# EAGLE design NRF24 (EAGLE 6.5.0)
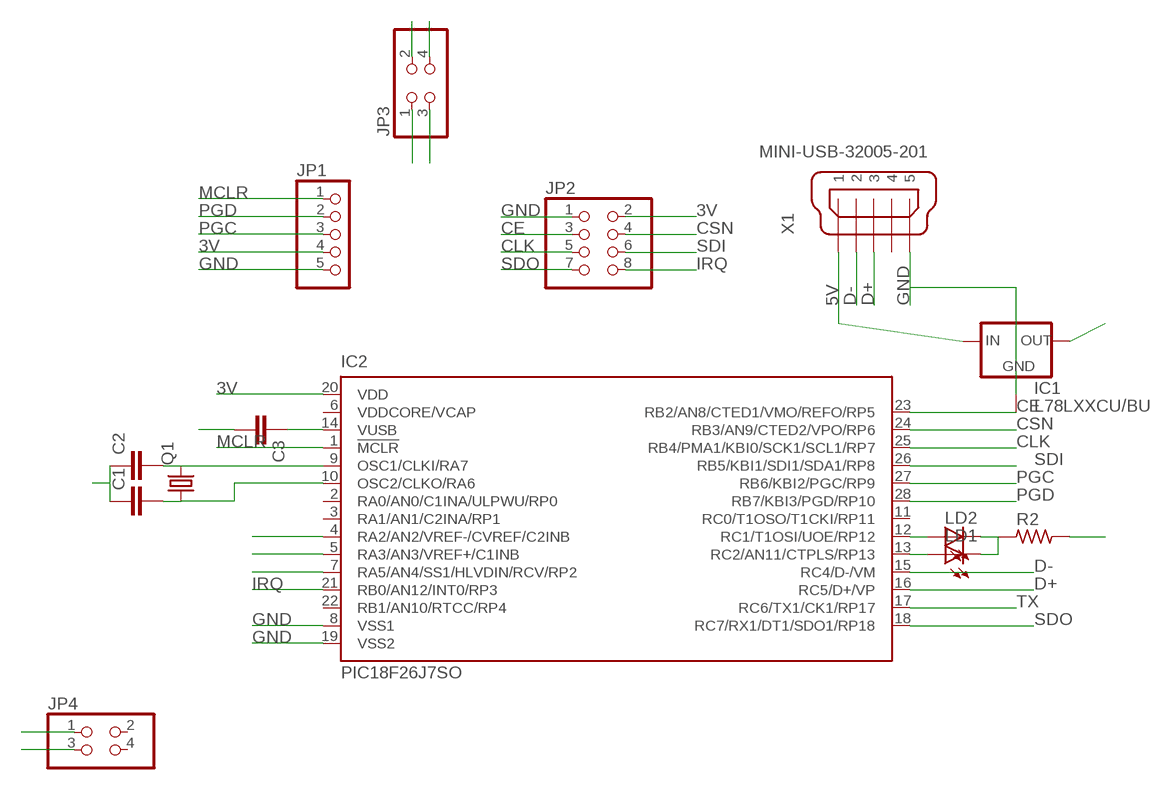
[diagram p0: schematic, sheet 1]

## Parts
C1  C-EU025-025X050  [C025-025X050]
C2  C-EU025-025X050  [C025-025X050]
C3  C-EU050-025X075  [C050-025X075]
IC1  L78LXXCU/BU  [SOT89]
IC2  PIC18F26J7SO  [SO28W]
JP1  PINHD-1X5  [1X05]
JP2  PINHD-2X4  [2X04]
JP3  PINHD-2X2  [2X02]
JP4  PINHD-2X2  [2X02]
LD1  LED5MM  [LED5MM]
LD2  LED5MM  [LED5MM]
Q1  CRYTALHC49S  [HC49/S]
R2  R_X0204/5  [0204/5]
X1  MINI-USB-32005-201  [32005-201]

## Nets
3V: IC1.1(OUT) IC2.20(VDD) JP1.4 JP2.2
5V: IC1.3(IN) X1.1
CE: IC2.23(RB2/AN8/CTED1/VMO/REFO/RP5) JP2.3
CLK: IC2.25(RB4/PMA1/KBI0/SCK1/SCL1/RP7) JP2.5
CSN: IC2.24(RB3/AN9/CTED2/VPO/RP6) JP2.4
D+: IC2.16(RC5/D+/VP) X1.3
D-: IC2.15(RC4/D-/VM) X1.2
GND: C1.1 C2.1 C3.2 IC1.2(GND) IC2.8(VSS1) IC2.19(VSS2) JP1.5 JP2.1 R2.2 X1.5
IRQ: IC2.21(RB0/AN12/INT0/RP3) JP2.8
MCLR: IC2.1(!MCLR) JP1.1
N$1: IC2.13(RC2/AN11/CTPLS/RP13) LD1.A
N$2: LD1.K(C) LD2.K(C) R2.1
N$3: IC2.12(RC1/T1OSI/UOE/RP12) LD2.A
N$4: C1.2 IC2.10(OSC2/CLKO/RA6) Q1.1
N$5: C2.2 IC2.9(OSC1/CLKI/RA7) Q1.2
N$6: C3.1 IC2.14(VUSB)
N$10: JP3.4
PGC: IC2.27(RB6/KBI2/PGC/RP9) JP1.3
PGD: IC2.28(RB7/KBI3/PGD/RP10) JP1.2
RA2: IC2.4(RA2/AN2/VREF-/CVREF/C2INB) JP3.1
RA3: IC2.5(RA3/AN3/VREF+/C1INB) JP3.3
RA5: IC2.7(RA5/AN4/SS1/HLVDIN/RCV/RP2) JP3.2
SDI: IC2.26(RB5/KBI1/SDI1/SDA1/RP8) JP2.6
SDO: IC2.18(RC7/RX1/DT1/SDO1/RP18) JP2.7 JP4.1
TX: IC2.17(RC6/TX1/CK1/RP17) JP4.3
Unconnected: IC1.4(GND1) IC2.2(RA0/AN0/C1INA/ULPWU/RP0) IC2.3(RA1/AN1/C2INA/RP1) IC2.6(VDDCORE/VCAP) IC2.11(RC0/T1OSO/T1CKI/RP11) IC2.22(RB1/AN10/RTCC/RP4) JP4.2 JP4.4 X1.4

## Library data of the parts
C1 C2 = rcl-2:C-EU: CAPACITOR, European symbol
C3 = qfm-trx1-24g:C-EU: CAPACITOR, European symbol
IC1 = v-reg-3:L78LXXCU/BU: VOLTAGE REGULATOR
IC2 = microchip-dspic:PIC18F26J*: PIC18F47J53 Family High-Performance USB Microcontrollers with nanoWatt XLP Technology Source: Data sheet <http://ww1.microchip.com/downloads/en/DeviceDoc/39964B.pdf>; MPN: PIC18F27J53-I/SO; OC_FARNELL: unknown; OC_NEWARK: 63R7838
JP1 = pinhead 2:PINHD-1X5: PIN HEADER
JP2 = pinhead 2:PINHD-2X4: PIN HEADER
JP3 JP4 = pinhead 2:PINHD-2X2: PIN HEADER
LD1 LD2 = led 2:LED: LED OSRAM: - CHIPLED LG R971, LG N971, LY N971, LG Q971, LY Q971, LO R971, LY R971 LH N974, LH R974 LS Q976, LO Q976, LY Q976 LO Q996 - Hyper CHIPLED LW Q18S LB Q993, LB Q99A, LB R99A - SideLED LS A670, LO A670, LY A670, LG A670, LP A670 LB A673, LV A673, LT A673, LW A673 LH A674 LY A675 LS A676, LA A676, LO A676, LY A676, LW A676 LS A679, LY A679, LG A679 - Hyper Micro SIDELED® LS Y876, LA Y876, LO Y876, LY Y876 LT Y87S - SmartLED LW L88C, LW L88S LB L89C, LB L89S, LG L890 LS L89K, LO L89K, LY L89K LS L896, LA L896, LO L896, LY L896 - TOPLED LS T670, LO T670, LY T670, LG T670, LP T670 LSG T670, LSP T670, LSY T670, LOP T670, LYG T670 LG T671, LOG T671, LSG T671 LB T673, LV T673, LT T673, LW T673 LH T674 LS T676, LA T676, LO T676, LY T676, LB T676, LH T676, LSB T676, LW T676 LB T67C, LV T67C, LT T67C, LS T67K, LO T67K, LY T67K, LW E67C LS E67B, LA E67B, LO E67B, LY E67B, LB E67C, LV E67C, LT E67C LW T67C LS T679, LY T679, LG T679 LS T770, LO T770, LY T770, LG T770, LP T770 LB T773, LV T773, LT T773, LW T773 LH T774 LS E675, LA E675, LY E675, LS T675 LS T776, LA T776, LO T776, LY T776, LB T776 LHGB T686 LT T68C, LB T68C - Hyper Mini TOPLED® LB M676 - Mini TOPLED Santana® LG M470 LS M47K, LO M47K, LY M47K Source: http://www.osram.convergy.de/
Q1 = crystal 2:CRYTAL: CRYSTAL
R2 = rc-master:R_: RESISTOR
X1 = con-cypressindustries 2:MINI-USB-: MINI USB-B Conector Source: www.cypressindustries.com

## Board
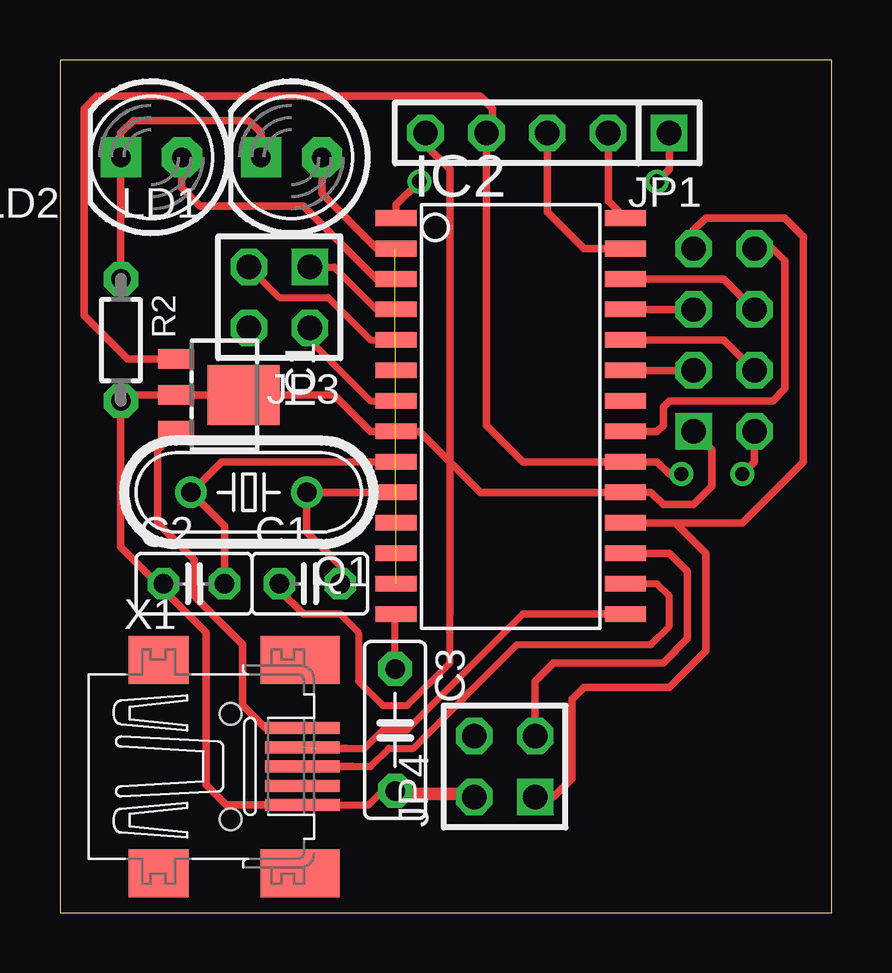
[diagram p1: board, top side]
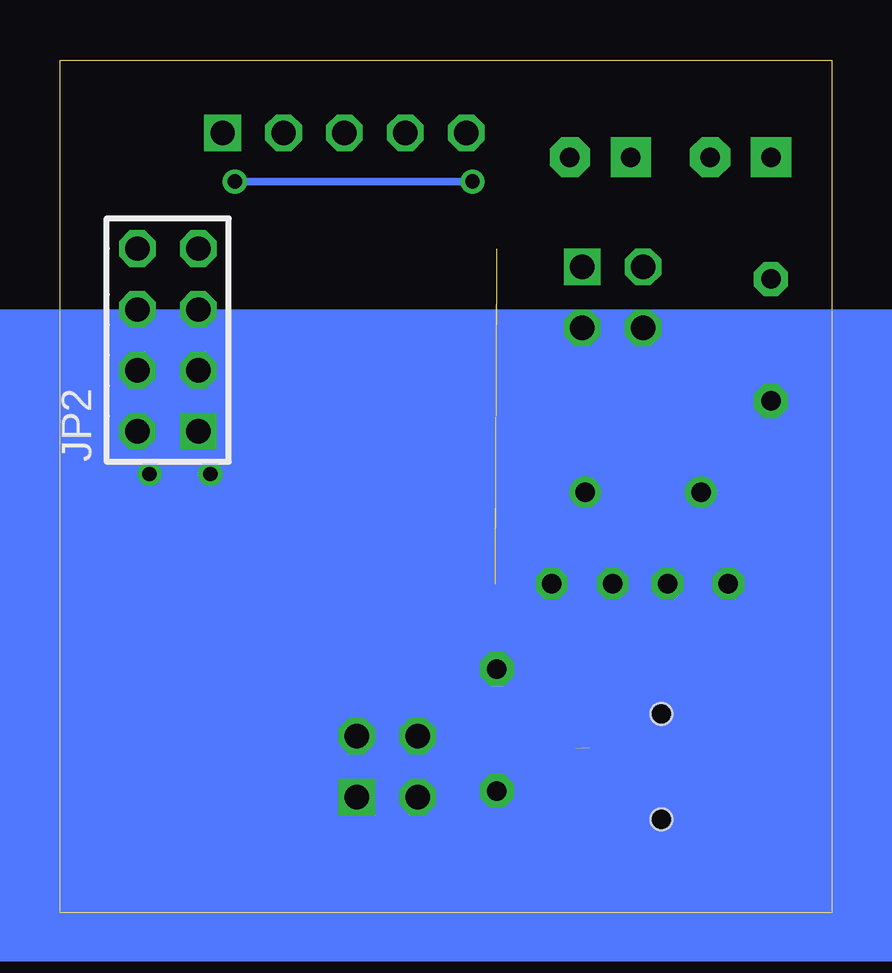
[diagram p2: board, bottom side, seen from below]

Size 32.18 x 35.55 mm. Coordinates in mm from the lower left corner, seen from the top.
Outline: 0,0 32.18,0 32.18,35.55 0,35.55 0,0
Copper layers (1*16): Top 0.035mm / dielectric 1.5mm / Bottom 0.035mm
Design rules "default": minimum track width 10mil, minimum drill 24mil, track to track 8mil, track to pad 8mil, pad to pad 8mil, via to via 8mil, smd to smd 8mil, copper to edge 40mil, drill to drill 8mil, minimum pad ring 10mil, minimum via ring 8mil, stop-mask expansion 4mil, vias tented up to drill 0mil, thermal gap 10mil

### Footprints (pad centres in the part's own frame; a part is rotated, then mirrored left to right if it is on the bottom)
C025-025X050 = drill 0.813 octagon: 1 -1.27,0; 2 1.27,0
C050-025X075 = drill 0.813 pad 1.422 octagon: 1 -2.54,0; 2 2.54,0
SOT89 = smd 0.8 x 1.5: 1 -1.5,-1.75; 2 0,-1.75; 3 1.5,-1.75 | smd 2.5 x 3: 4 0,1.05
SO28W = smd 0.65 x 1.7: 1 -7.62,-4.78; 2 -6.35,-4.78; 3 -5.08,-4.78; 4 -3.81,-4.78; 5 -2.54,-4.78; 6 -1.27,-4.78; 7 0,-4.78; 8 1.27,-4.78; 9 2.54,-4.78; 10 3.81,-4.78; 11 5.08,-4.78; 12 6.35,-4.78; 13 7.62,-4.78; 14 8.89,-4.78; 15 8.89,4.78; 16 7.62,4.78; 17 6.35,4.78; 18 5.08,4.78; 19 3.81,4.78; 20 2.54,4.78; 21 1.27,4.78; 22 0,4.78; 23 -1.27,4.78; 24 -2.54,4.78; 25 -3.81,4.78; 26 -5.08,4.78; 27 -6.35,4.78; 28 -7.62,4.78
1X05 = drill 1.016 square: 1 -5.08,0 | drill 1.016 octagon: 2 -2.54,0; 3 0,0; 4 2.54,0; 5 5.08,0
2X04 = drill 1.016 square: 1 -3.81,-1.27 | drill 1.016 octagon: 2 -3.81,1.27; 3 -1.27,-1.27; 4 -1.27,1.27; 5 1.27,-1.27; 6 1.27,1.27; 7 3.81,-1.27; 8 3.81,1.27
2X02 = drill 1.016 square: 1 -1.27,-1.27 | drill 1.016 octagon: 2 -1.27,1.27; 3 1.27,-1.27; 4 1.27,1.27
LED5MM = drill 0.813 pad 1.676 octagon: A -1.27,0 | drill 0.813 pad 1.676 square: K 1.27,0
HC49/S = drill 0.813: 1 -2.413,0; 2 2.413,0
0204/5 = drill 0.813 pad 1.422 octagon: 1 -2.54,0; 2 2.54,0
32005-201 = smd 3.1 x 0.5: 1 3,1.6; 2 3,0.8; 3 3,0; 4 3,-0.8; 5 3,-1.6 | smd 2.5 x 2: M1 -3,-4.45; M2 -3,4.45 | smd 3.3 x 2: M3 2.9,4.45; M4 2.9,-4.45 | hole 0.9: 0,2.2; 0,-2.2

### Placement (x,y rotation side)
C1  10.41,13.72 0 top
C2  5.59,13.72 0 top
C3  13.97,7.62 270 top
IC1  6.6,21.59 270 top
IC2  18.8,21.34 270 top
JP1  20.32,32.51 180 top
JP2  27.69,23.88 90 bottom
JP3  9.14,25.65 180 top
JP4  18.54,6.1 90 top
LD1  9.65,31.5 180 top
LD2  3.81,31.5 180 top
Q1  7.87,17.53 180 top
R2  2.54,23.88 270 top
X1  7.11,6.1 0 top

### Tracks (layer width: path | path; a pad name or v marks a point on that pad's centre or on a via)
3V  (via drill 0.6)
  Top 0.305: JP2.2 28.96,18.8 v28.45,18.29 | v25.91,18.29 25.4,18.29 24.89,18.8 IC2.20 19.3,18.8 17.78,20.32 JP1.4 18.03,32.77 18.03,33.53 17.53,34.04 1.52,34.04 1.02,33.53 1.02,24.89 2.82,23.09 IC1.1
  Bottom 0.305: v25.91,18.29 v28.45,18.29
5V
  Top 0.305: X1.1 8.56,7.7 7.62,8.64 7.62,11.18 5.59,13.21 5.59,14.73 4.06,16.26 4.06,19.3 IC1.3
CE
  Top 0.305: JP2.3 IC2.23
CLK
  Top 0.305: JP2.5 IC2.25
CSN
  Top 0.305: JP2.4 27.69,23.88 IC2.24
D+
  Top 0.3: 12.19,6.1 12.95,6.1 13.72,6.86 14.73,6.86 19.05,11.18 24.64,11.18 25.4,11.94 25.4,13.21 24.89,13.72 IC2.16
  Top 0.305: X1.3 12.19,6.1
D-  (1 unrouted)
  Top 0.3: 11.94,6.86 12.7,6.86 13.46,7.62 14.48,7.62 19.3,12.45
  Top 0.305: IC2.15 19.3,12.45 | 10.67,6.86 11.94,6.86
GND
  Top 0.3: 11.68,12.45 12.45,11.68 12.45,9.65 13.46,8.64 14.48,8.64 16.26,10.41 16.26,12.45 | C3.2 17.02,5.08 17.27,4.83 14.22,4.83 C3.2 | C3.2 13.46,5.08 13.21,4.83 12.95,4.57 12.88,4.5 X1.5
  Top 0.305: 16.26,18.8 17.53,17.53 IC2.19 24.64,17.53 25.15,17.02 26.42,17.02 27.18,17.78 27.18,19.3 JP2.1 | 16.26,18.8 14.99,20.07 IC2.8 12.95,20.07 11.43,21.59 IC1.2 2.79,21.59 R2.2 2.54,15.24 4.06,13.72 | JP1.5 15.24,32 16.26,30.99 16.26,18.8 | X1.5 6.93,4.5 6.1,5.33 6.1,11.68 4.06,13.72 | C1.1 9.14,13.46 10.16,12.45 11.68,12.45 | 16.26,12.45 16.26,18.8 | C2.1 4.06,13.72
IRQ
  Top 0.3: JP2.8 29.72,27.69 30.23,27.18
  Top 0.305: 30.23,27.18 30.23,21.84 29.72,21.34 25.4,21.34 25.15,21.08 25.15,20.32 24.89,20.07 IC2.21
MCLR  (via drill 0.6)
  Top 0.305: IC2.1 14.02,29.51 v14.99,30.48 | JP1.1 25.4,30.99 v24.89,30.48
  Bottom 0.305: v14.99,30.48 v24.89,30.48
N$1  (1 unrouted)
  Top 0.305: 13.97,27.69 13.21,27.69 10.92,29.97 LD1.A
N$2
  Top 0.305: R2.1 LD2.K 2.54,32.51 3.05,33.02 7.87,33.02 8.38,32.51 LD1.K
N$3  (1 unrouted)
  Top 0.305: 13.97,26.42 13.21,26.42 10.16,29.46 5.84,29.46 5.08,30.23 LD2.A
N$4
  Top 0.305: IC2.10 Q1.1 10.29,15.88 11.68,14.48 C1.2
N$5
  Top 0.305: IC2.9 6.73,18.8 Q1.2 6.86,16.13 C2.2
N$6
  Top 0.3: C3.1 13.97,12.4 IC2.14
PGC
  Top 0.305: JP1.3 20.32,29.21 21.84,27.69 IC2.27
PGD
  Top 0.305: JP1.2 22.86,29.67 IC2.28
RA2
  Top 0.3: JP3.1 11.43,26.92 13.21,25.15 IC2.4
RA3
  Top 0.3: JP3.3 9.14,25.65 11.18,25.65 12.95,23.88 IC2.5
RA5
  Top 0.3: JP3.2 10.41,23.88 12.95,21.34 IC2.7
SDI
  Top 0.305: JP2.6 27.69,26.42 IC2.26
SDO
  Top 0.305: IC2.18 25.65,16.26 | 25.65,16.26 28.45,16.26 30.99,18.8 30.99,28.19 30.23,28.96 26.92,28.96 26.42,28.45 JP2.7 | JP4.1 20.57,4.83 21.34,5.59 21.34,8.89 21.84,9.4 25.4,9.4 26.92,10.92 26.92,14.99 25.65,16.26
TX
  Top 0.305: JP4.3 19.81,9.65 20.57,10.41 25.15,10.41 26.16,11.43 26.16,14.22 25.4,14.99 IC2.17
(copper drawn outside any net)
  shapes: Bottom area x1